# EAGLE schematic Atmega32Dip40 (EAGLE 7.6.0)
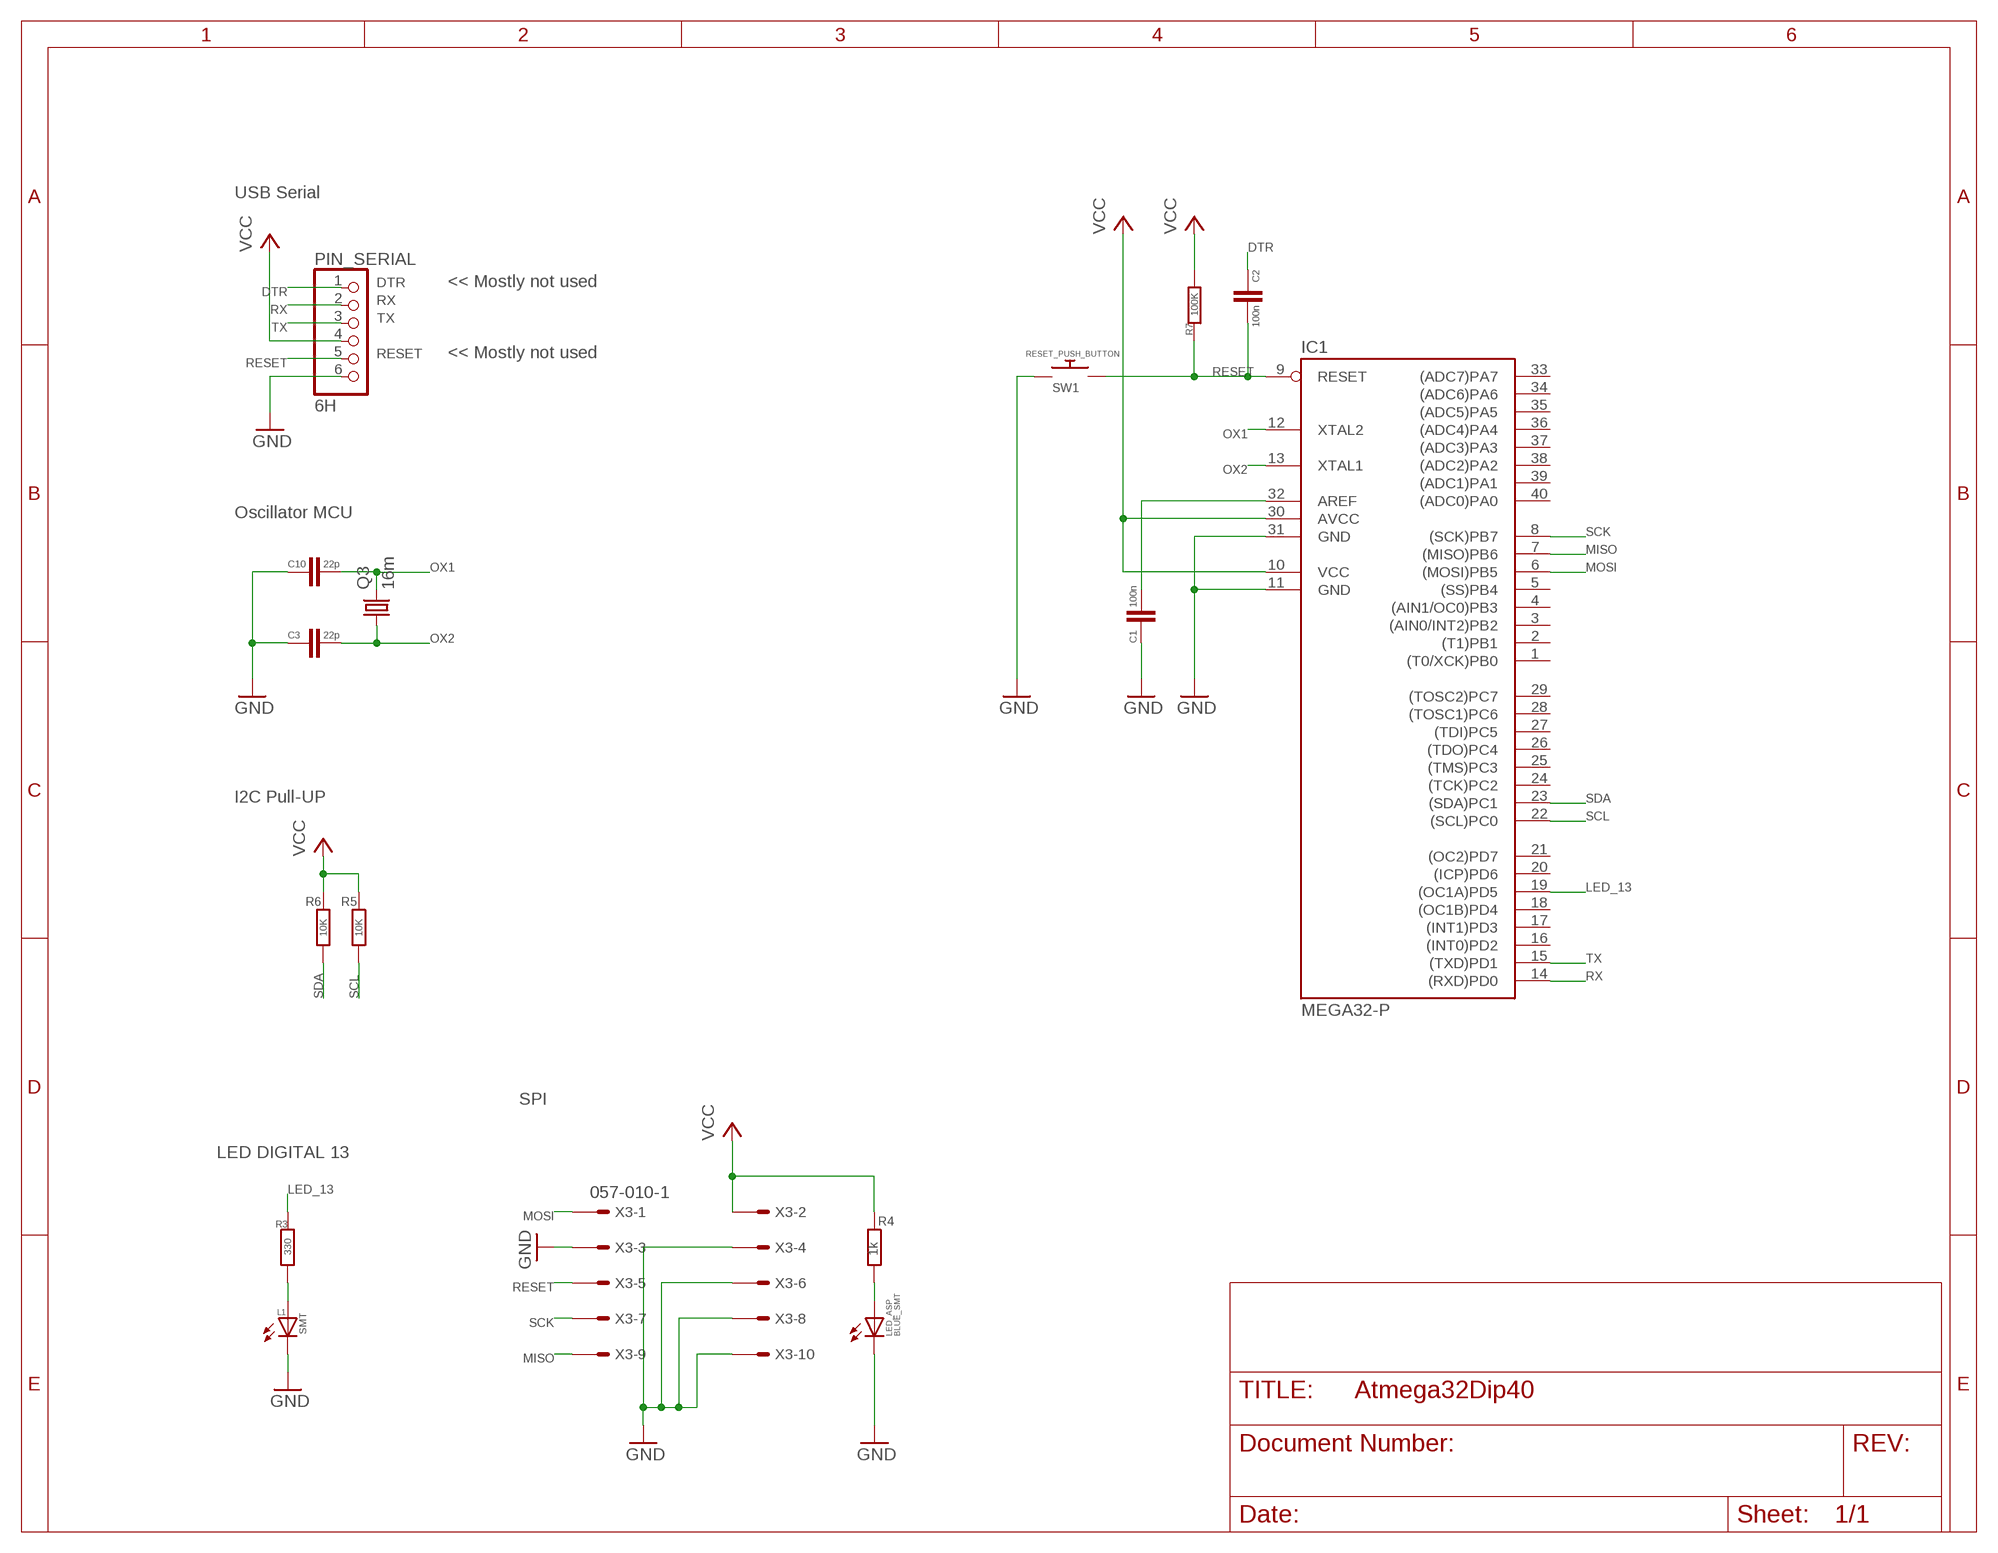
[diagram p0: schematic, sheet 1]

## Parts
C1  100n  C-EUC1206  [C1206]
C2  100n  C-EUC1206  [C1206]
C3  22p  C-EUC1206  [C1206]
C10  22p  C-EUC1206  [C1206]
IC1  MEGA32-P  [DIL40]
L1  SMT  LEDSMT1206  [1206]
LED_ASP  BLUE_SMT  LEDSMT1206  [1206]
PIN_SERIAL  6H  PINHD-1X6  [1X06]
Q3  16m  CRYSTALHC49UP  [HC49UP]
R3  330  R-EU_R1206  [R1206]
R4  1k  R-EU_R1206  [R1206]
R5  10K  R-EU_0204/7  [0204/7]
R6  10K  R-EU_0204/7  [0204/7]
R7  100K  R-EU_0204/7  [0204/7]
RESET_PUSH_BUTTON  SW1  SWITCH_PUSHBUTTONEVQ-PE  [TACT_PANA-EVQ]
X3  057-010-1  [057-010-1]

## Nets
DTR: C2.1 PIN_SERIAL.1
GND: C1.1 C3.1 C10.1 IC1.11(GND) IC1.31(GND) L1.C LED_ASP.C PIN_SERIAL.6 RESET_PUSH_BUTTON.P$1 X3.3 X3.4 X3.6 X3.8 X3.10
LED_13: IC1.19((OC1A)PD5) R3.1
MISO: IC1.7((MISO)PB6) X3.9
MOSI: IC1.6((MOSI)PB5) X3.1
N$2: L1.A R3.2
N$3: LED_ASP.A R4.2
N$4: C1.2 IC1.32(AREF)
OX1: C10.2 IC1.12(XTAL2) Q3.2
OX2: C3.2 IC1.13(XTAL1) Q3.1
RESET: C2.2 IC1.9(RESET) PIN_SERIAL.5 R7.1 RESET_PUSH_BUTTON.P$2 X3.5
RX: IC1.14((RXD)PD0) PIN_SERIAL.2
SCK: IC1.8((SCK)PB7) X3.7
SCL: IC1.22((SCL)PC0) R5.2
SDA: IC1.23((SDA)PC1) R6.2
TX: IC1.15((TXD)PD1) PIN_SERIAL.3
VCC: IC1.10(VCC) IC1.30(AVCC) PIN_SERIAL.4 R4.1 R5.1 R6.1 R7.2 X3.2
Unconnected: IC1.1((T0/XCK)PB0) IC1.2((T1)PB1) IC1.3((AIN0/INT2)PB2) IC1.4((AIN1/OC0)PB3) IC1.5((SS)PB4) IC1.16((INT0)PD2) IC1.17((INT1)PD3) IC1.18((OC1B)PD4) IC1.20((ICP)PD6) IC1.21((OC2)PD7) IC1.24((TCK)PC2) IC1.25((TMS)PC3) IC1.26((TDO)PC4) IC1.27((TDI)PC5) IC1.28((TOSC1)PC6) IC1.29((TOSC2)PC7) IC1.33((ADC7)PA7) IC1.34((ADC6)PA6) IC1.35((ADC5)PA5) IC1.36((ADC4)PA4) IC1.37((ADC3)PA3) IC1.38((ADC2)PA2) IC1.39((ADC1)PA1) IC1.40((ADC0)PA0)

## Notes on the sheet
- USB Serial
- DTR | << Mostly not used
- RX
- TX
- RESET | << Mostly not used
- Oscillator MCU
- I2C Pull-UP
- SPI
- LED DIGITAL 13

## Library data of the parts
C1-C3 C10 = resistor:C-EU: CAPACITOR, European symbol
IC1 = atmel:MEGA32-P: MICROCONTROLLER 32 Kbytes FLASH 2 Kbytes SRAM 1 Kbytes EEPROM USART 8-channel 10 bit ADC Source: www.atmel.com .. doc2503.pdf; MPN: ATMEGA32-16PU; OC_FARNELL: 1661729; OC_NEWARK: 51P1794
L1 LED_ASP = adafruit:LED: LED OSRAM: - CHIPLED LG R971, LG N971, LY N971, LG Q971, LY Q971, LO R971, LY R971 LH N974, LH R974 LS Q976, LO Q976, LY Q976 LO Q996 - Hyper CHIPLED LW Q18S LB Q993, LB Q99A, LB R99A - SideLED LS A670, LO A670, LY A670, LG A670, LP A670 LB A673, LV A673, LT A673, LW A673 LH A674 LY A675 LS A676, LA A676, LO A676, LY A676, LW A676 LS A679, LY A679, LG A679 - Hyper Micro SIDELED® LS Y876, LA Y876, LO Y876, LY Y876 LT Y87S - SmartLED LW L88C, LW L88S LB L89C, LB L89S, LG L890 LS L89K, LO L89K, LY L89K LS L896, LA L896, LO L896, LY L896 - TOPLED LS T670, LO T670, LY T670, LG T670, LP T670 LSG T670, LSP T670, LSY T670, LOP T670, LYG T670 LG T671, LOG T671, LSG T671 LB T673, LV T673, LT T673, LW T673 LH T674 LS T676, LA T676, LO T676, LY T676, LB T676, LH T676, LSB T676, LW T676 LB T67C, LV T67C, LT T67C, LS T67K, LO T67K, LY T67K, LW E67C LS E67B, LA E67B, LO E67B, LY E67B, LB E67C, LV E67C, LT E67C LW T67C LS T679, LY T679, LG T679 LS T770, LO T770, LY T770, LG T770, LP T770 LB T773, LV T773, LT T773, LW T773 LH T774 LS E675, LA E675, LY E675, LS T675 LS T776, LA T776, LO T776, LY T776, LB T776 LHGB T686 LT T68C, LB T68C - Hyper Mini TOPLED® LB M676 - Mini TOPLED Santana® LG M470 LS M47K, LO M47K, LY M47K Source: http://www.osram.convergy.de/
PIN_SERIAL = adafruit:PINHD-1X6: PIN HEADER
Q3 = adafruit:CRYSTAL: CRYSTAL; OC_FARNELL: unknown; OC_NEWARK: unknown
R3-R7 = resistor:R-EU_: RESISTOR, European symbol
RESET_PUSH_BUTTON = adafruit:SWITCH_PUSHBUTTON: Buttons SOFTTOUCHSMD_SJ - Soft touch temporary push button (Super Junk Akihabara) Compatible with SKPMANE010 [Mouser: 688-SKPMAN] C&K_KSS = Digikey: KSS221GLFS
X3 = con-panduit:057-010-: CONNECTOR 10-pin series 057 contact pc board low profile headers; OC_FARNELL: unknown; OC_NEWARK: unknown